# Altium schematic sheet Sheet_SiPM.SchDoc
size A4; SheetNumber: 1; SheetTotal: 1
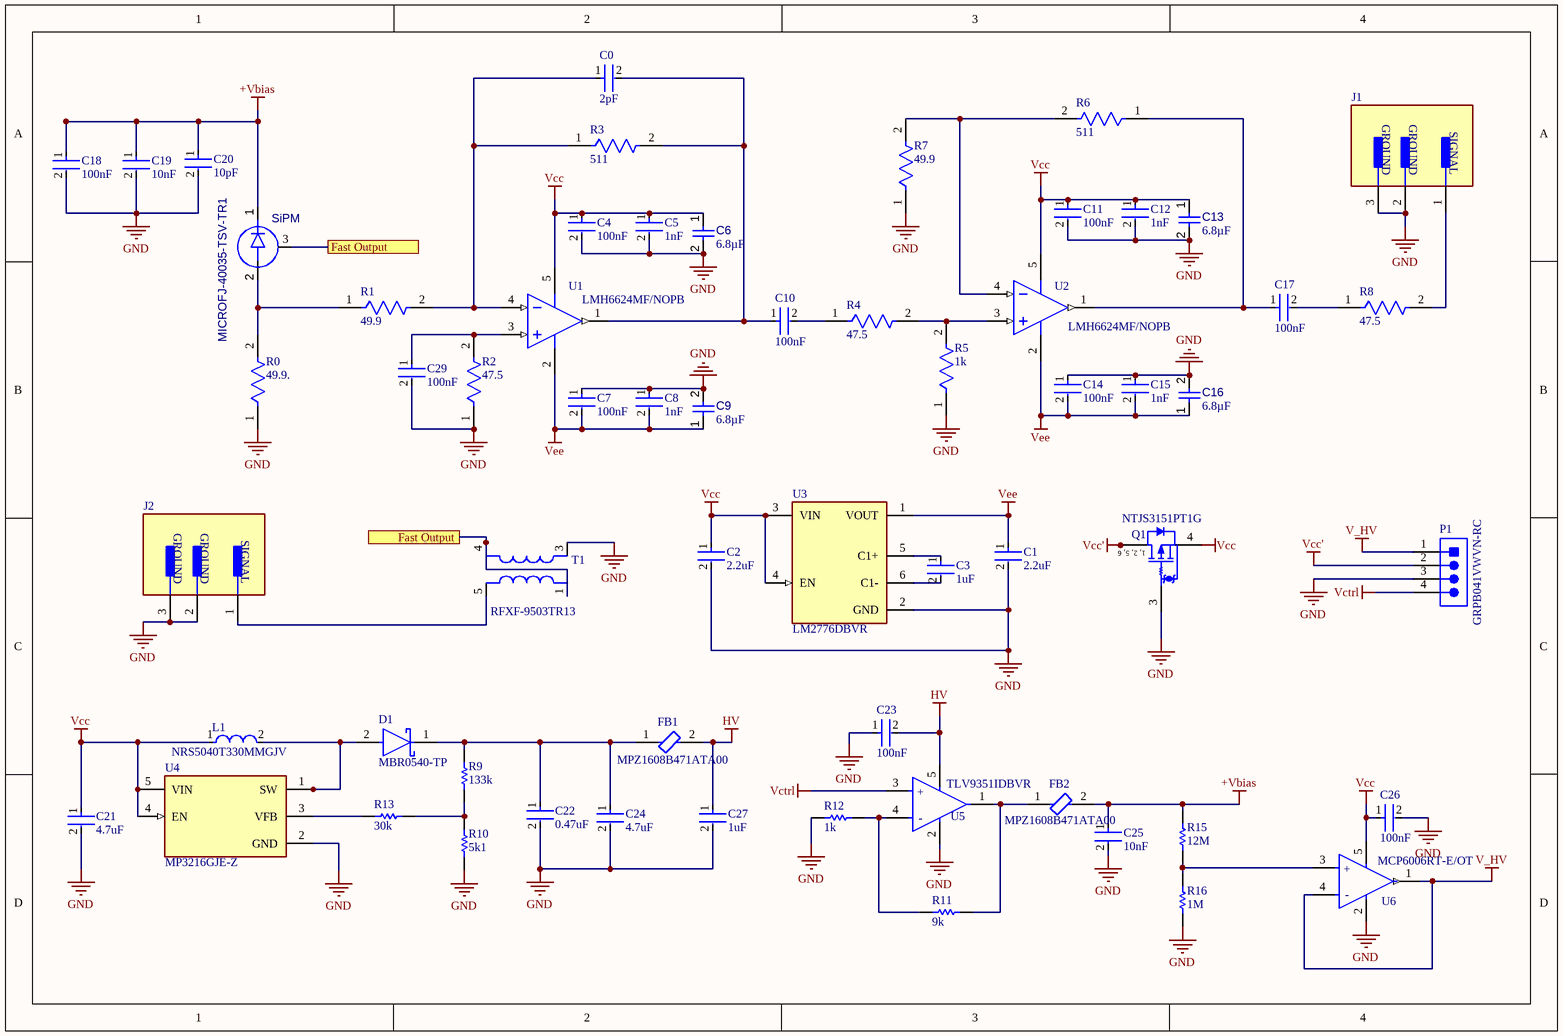
[diagram p0: Sheet_SiPM.SchDoc]

## Parts
C0  2pF  [FP-0603-L_1_6_0_15-W_0_81-MFG]
C1  2.2uF  [FP-GRM188-0_2-MFG]
C2  2.2uF  [FP-GRM188-0_2-MFG]
C3  1uF  [FP-CC0603-DA-MFG]
C4  100nF  [FP-CC0603-DA-MFG]
C5  1nF  [FP-CC0603-DA-MFG]
C6  value 6.8µF  [TPSA685K016R1500-Footprint-1]  (hidden comment: TPSA685K016R1500)
C7  100nF  [FP-CC0603-DA-MFG]
C8  1nF  [FP-CC0603-DA-MFG]
C9  value 6.8µF  [TPSA685K016R1500-Footprint-1]  (hidden comment: TPSA685K016R1500)
C10  100nF  [FP-CC0603-DA-MFG]
C11  100nF  [FP-CC0603-DA-MFG]
C12  1nF  [FP-CC0603-DA-MFG]
C13  value 6.8µF  [TPSA685K016R1500-Footprint-1]  (hidden comment: TPSA685K016R1500)
C14  100nF  [FP-CC0603-DA-MFG]
C15  1nF  [FP-CC0603-DA-MFG]
C16  value 6.8µF  [TPSA685K016R1500-Footprint-1]  (hidden comment: TPSA685K016R1500)
C17  100nF  [FP-CC0603-DA-MFG]
C18  100nF  [FP-CC0603-DA-MFG]
C19  10nF  [FP-CC0603-DA-MFG]
C20  10pF  [FP-AC0603-MFG]
C21  4.7uF  [FP-0603-L_1_6_0_1-W_0_8_0-MFG]
C22  0.47uF  [FP-0603-L_1_6_0_1-W_0_8_0-MFG]
C23  100nF  [FP-CC0603-DA-MFG]
C24  4.7uF  [FP-0603-L_1_6_0_15-W_0_8-MFG]
C25  10nF  [FP-CC0603-DA-MFG]
C26  100nF  [FP-CC0603-DA-MFG]
C27  1uF  [FP-CC0603-DA-MFG]
C29  100nF  [FP-CC0603-DA-MFG]
D1  MBR0540-TP  [FP-SOD-123-MFG]
FB1  MPZ1608B471ATA00  [FP-MPZ1608-0_8-MFG]
FB2  MPZ1608B471ATA00  [FP-MPZ1608-0_8-MFG]
J1  2337019-1  [FP-2337019-1-MFG]  (value not drawn)
J2  2337019-1  [FP-2337019-1-MFG]  (value not drawn)
L1  NRS5040T330MMGJV  [FP-NR5040-H_4_0-MFG]
P1  GRPB041VWVN-RC  [SLIN-GRPB041VWVN-RC_V]
Q1  NTJS3151PT1G  [ONSC-SC70-6-419B-02_W_V]
R0  49.9.  [FP-RNCP0603-MFG]
R1  49.9  [FP-RNCP0603-MFG]
R2  47.5  [FP-RNCP0603-MFG]
R3  511  [FP-MCT0603-MFG]
R4  47.5  [FP-RNCP0603-MFG]
R5  1k  [FP-MCT0603-MFG]
R6  511  [FP-MCT0603-MFG]
R7  49.9  [FP-RNCP0603-MFG]
R8  47.5  [FP-RNCP0603-MFG]
R9  133k  [RESC2013X60X35LL10T20]
R10  5k1  [RESC2013X60X35LL10T20]
R11  9k  [RESC2013X60X35LL10T20]
R12  1k  [RESC2013X60X35LL10T20]
R13  30k  [RESC2013X60X35LL10T20]
R15  12M  [RESC2013X60X35LL10T20]
R16  1M  [RESC2013X60X35LL10T20]
SiPM  MICROFJ-40035-TSV-TR1
T1  RFXF-9503TR13  [RFXF-9503TR13-Footprint-1]
U1  LMH6624MF/NOPB  [DBV0005A_L]
U2  LMH6624MF/NOPB  [DBV0005A_L]
U3  LM2776DBVR  [FP-DBV0006A-MFG]
U4  MP3216GJE-Z  [MP3216GJE-Z-Footprint-1]
U5  TLV9351IDBVR  [FP-DBV0005A-MFG]
U6  MCP6006RT-E/OT  [FP-C04-091-OT-MFG]

## Ports
Fast Output (see Sheet_SiPM[1A]), Fast Output (see Sheet_SiPM[1C])

## Nets
+Vbias: C18.1 C19.1 C20.1 C25.1 FB2.2 R15.2 SiPM.1(K)
GND: C1.2 C2.2 C4.2 C5.2 C6.2 C7.1 C8.1 C9.2 C11.2 C12.2 C13.2 C14.1 C15.1 C16.2 C18.2 C19.2 C20.2 C21.2 C22.2 C23.1 C24.2 C25.2 C26.2 C27.2 C29.2 J1.2(GROUND) J1.3(GROUND) J2.2(GROUND) J2.3(GROUND) P1.3 Q1.3(G) R0.1 R2.1 R5.1 R7.1 R10.1 R12.2 R16.1 T1.3 U3.2(GND) U4.2(GND) U5.2(V-) U6.2(VSS)
HV: C23.2 C27.1 FB1.2 U5.5(V+)
V_HV: P1.1 U6.1(VOUT) U6.4(VIN-)
Vcc: C2.1 C4.1 C5.1 C6.1 C11.1 C12.1 C13.1 C21.1 C26.1 L1.1 Q1.4(S) U1.5(V+) U2.5(V+) U3.3(VIN) U3.4(EN) U4.4(EN) U4.5(VIN) U6.5(VDD)
Vcc': P1.2 Q1.1(D) Q1.2(D) Q1.5(D) Q1.6(D)
Vctrl: P1.4 U5.3(IN+)
Vee: C1.1 C7.2 C8.2 C9.1 C14.2 C15.2 C16.1 U1.2(V-) U2.2(V-) U3.1(VOUT)
Fast Output: SiPM.3(F) T1.1 T1.4 ; port Fast Output
NetC0_1: C0.1 R1.2 R3.1 U1.4(IN-)
NetC0_2: C0.2 C10.1 R3.2 U1.1(OUT)
NetC3_1: C3.1 U3.5(C1+)
NetC3_2: C3.2 U3.6(C1-)
NetC10_2: C10.2 R4.1
NetC17_1: C17.1 R6.1 U2.1(OUT)
NetC17_2: C17.2 R8.1
NetC22_1: C22.1 C24.1 D1.1(C) FB1.1 R9.2
NetC29_1: C29.1 R2.2 U1.3(IN+)
NetD1_2: D1.2(A) L1.2 U4.1(SW)
NetFB2_1: FB2.1 R11.1 U5.1(OUT)
NetJ1_1: J1.1(SIGNAL) R8.2
NetJ2_1: J2.1(SIGNAL) T1.5
NetR0_2: R0.2 R1.1 SiPM.2(A)
NetR4_2: R4.2 R5.2 U2.3(IN+)
NetR6_2: R6.2 R7.2 U2.4(IN-)
NetR9_1: R9.1 R10.2 R13.1
NetR11_2: R11.2 R12.1 U5.4(IN-)
NetR13_2: R13.2 U4.3(VFB)
NetR15_1: R15.1 R16.2 U6.3(VIN+)

## Notes on the sheet
- (in symbol CMP-00252-117321646-1) +; -
- (in symbol CMP-1058-00634-1) 1, 2, 5, 6
- (in symbol CMP-04895-000384-1) +; -

## Library data of the parts
C0 = CMP-2006-04257-2: General Purpose Ceramic Capacitor, 0603, 1pF, 0.1pF, NP0, 30ppm/°C, 50V; Dielectric: C0G; Voltage Rating: 50V; Max Operating Temperature: 125°C; Lead Free: Lead Free; Mount: Surface Mount; Length: 1.6mm; Thickness: 0.035inch; Series: -; RoHS Compliant: Yes; Depth: 0.81mm; Construction: Flat; Voltage Rating (DC): 50V; Package Quantity: 4000; Case Code (Imperial): 0603; Height: 0.035mm; Case Code (Metric): 1608; Capacitance: 1pF; Packaging: Tape and Reel; Case/Package: 0603; Termination: SMD/SMT; Width: 0.032inch; Min Operating Temperature: -55°C; Radiation Hardening: No
C1 C2 = CMP-06035-057307-1: Chip Multilayer Ceramic Capacitors for General Purpose, 0603, 2.2uF, X7R, 15%, 10%, 16V; Case/Package: 0603
C3 = CMP-03422-000924-1: CAP CER 1UF 16V X7R 0603; Manufacturer: YAGEO; Manufacturer Part Number: CC0603KRX7R7BB105; Tolerance: 0.1; Temperature Coefficient: 15%; Material: Ceramic; Package: CC0603-DA; RoHS: TRUE; Device Class L2: Capacitors; Temperature Characteristic: X7R; Temperature: -55°C to +125°C; Temperature Range Low: -55°C; Automotive: No; ComponentLink2Description: Datasheet; Value: 1 uF; Lead Free: Yes; Capacitance: 1 uF; ComponentLink2URL: http://www.yageo.com/documents/recent/UPY-GPHC_X7R_6.3V-to-50V_18.pdf; Device Class L1: Passive Components; Voltage: 16 V; Octopart: https://octopart.com/cc0603krx7r7bb105-yageo-42271928; Category: Cap; Digikey Description: CAP CER 1UF 16V X7R 0603; Footprint Url: http://www.yageo.com/exep/pages/download/literatures/UPY-C_GEN_24.pdf; Height: 0.9mm; Voltage Rating: 16 V; Temperature Range High: +125°C; Mouser Description: Multilayer Ceramic Capacitor, CC Series, 1 - F, - 10%, X7R, 16 V, 0603 [1608 Metric]; Device Class L3: Ceramic Capacitors
C4 C7 C10 C11 C14 C17 C26 C29 = CMP-2000-05002-2: CAP CER 0.1UF 16V X7R 0603; Manufacturer Part Number: CC0603KRX7R7BB104; Manufacturer: YAGEO; Tolerance: 0.1; Temperature Coefficient: 15%; Material: Ceramic; Voltage Rating: 16 V; Package: CC0603-DA; ComponentLink2Description: Datasheet; Octopart: https://octopart.com/cc0603krx7r7bb104-yageo-192941; Temperature Range High: +125°C; Digikey Description: CAP CER 0.1UF 16V X7R 0603; Value: 100 nF; Voltage: 16 V; Device Class L2: Capacitors; Height: 0.9mm; Temperature: -55°C to +125°C; Device Class L1: Passive Components; Device Class L3: Ceramic Capacitors; ComponentLink2URL: http://www.yageo.com/documents/recent/UPY-GPHC_X7R_6.3V-to-50V_18.pdf; Footprint Url: http://www.yageo.com/exep/pages/download/literatures/UPY-C_GEN_24.pdf; RoHS: TRUE; Temperature Range Low: -55°C; Temperature Characteristic: X7R; Lead Free: Yes; Capacitance: 100 nF; Category: Cap; Mouser Description: Multilayer Ceramic Capacitor, CC Series, 0.1 - F, - 10%, X7R, 16 V, 0603 [1608 Metric]; Automotive: No
C5 C8 C12 C15 = CMP-03422-001144-1: CAP CER 1000PF 25V X7R 0603; Manufacturer: YAGEO; Manufacturer Part Number: CC0603KRX7R8BB102; Value: 1.0 nF; Material: Ceramic; Temperature Coefficient: 15%; Tolerance: 0.1; Category: Cap; Voltage Rating: 25 V; Temperature: -55°C to +125°C; Device Class L3: Ceramic Capacitors; Octopart: https://octopart.com/cc0603krx7r8bb102-yageo-9291798; Voltage: 25 V; Lead Free: Yes; Digikey Description: CAP CER 1000PF 25V X7R 0603; Height: 0.9mm; ComponentLink2URL: http://www.yageo.com/documents/recent/UPY-GPHC_X7R_6.3V-to-50V_18.pdf; RoHS: TRUE; ComponentLink2Description: Datasheet; Package: CC0603-DA; Device Class L2: Capacitors; Temperature Range Low: -55°C; Mouser Description: Multilayer Ceramic Capacitors MLCC - SMD/SMT 1.0nF 25V X7R 10%; Capacitance: 1.0 nF; Temperature Characteristic: X7R; Automotive: No; Footprint Url: http://www.yageo.com/exep/pages/download/literatures/UPY-C_GEN_24.pdf; Device Class L1: Passive Components; Temperature Range High: +125°C
C6 C9 C13 C16 = CMP-001-00083-2: Tantalum Capacitor, Polarized, Tantalum (dry/solid), 16V, 10% +Tol, 10% -Tol, 6.8uF, Surface Mount, 1206; RoHS Compliant: Yes; Min Operating Temperature: -55°C; Capacitor Type: Tantalum; Pins: 2; Max Operating Temperature: 125°C; Mounting Technology: Surface Mount; Case/Package: 1206
C18 C23 = CMP-2100-03601-2: CAP CER 0.1UF 50V X7R 0603; Manufacturer: YAGEO; Manufacturer Part Number: CC0603KRX7R9BB104; Material: Ceramic; Temperature Coefficient: 15%; Tolerance: 0.1; Height: 0.9mm; Voltage: 50 V; ComponentLink2Description: Datasheet; Device Class L2: Capacitors; Temperature Range High: +125°C; Category: Cap; Capacitance: 100 nF; Footprint Url: http://www.yageo.com/exep/pages/download/literatures/UPY-C_GEN_24.pdf; ComponentLink2URL: http://www.yageo.com/documents/recent/UPY-GPHC_X7R_6.3V-to-50V_18.pdf; Package: CC0603-DA; Temperature: -55°C to +125°C; Voltage Rating: 50 V; Temperature Characteristic: X7R; Device Class L1: Passive Components; Temperature Range Low: -55°C; RoHS: TRUE; Automotive: No; Value: 100 nF; Device Class L3: Ceramic Capacitors; Octopart: https://octopart.com/cc0603krx7r9bb104-yageo-42244635; Mouser Description: Multilayer Ceramic Capacitor, CC Series, 0.1 - F, - 10%, X7R, 50 V, 0603 [1608 Metric]; Lead Free: Yes; Digikey Description: CAP CER 0.1UF 50V X7R 0603
C19 C25 = CMP-2100-03600-2: CAP CER 10000PF 50V X7R 0603; Manufacturer Part Number: CC0603KRX7R9BB103; Manufacturer: YAGEO; Tolerance: 0.1; Material: Ceramic; Temperature Coefficient: 15%; Mouser Description: Multilayer Ceramic Capacitor, CC Series, 0.01 - F, - 10%, X7R, 50 V, 0603 [1608 Metric]; Digikey Description: CAP CER 10000PF 50V X7R 0603; Height: 0.9mm; Category: Cap; Temperature Characteristic: X7R; Footprint Url: http://www.yageo.com/exep/pages/download/literatures/UPY-C_GEN_24.pdf; Lead Free: Yes; Voltage Rating: 50 V; Temperature: -55°C to +125°C; Device Class L3: Ceramic Capacitors; ComponentLink2Description: Datasheet; Voltage: 50 V; Package: CC0603-DA; Octopart: https://octopart.com/cc0603krx7r9bb103-yageo-192938; Automotive: No; Temperature Range High: +125°C; Temperature Range Low: -55°C; Value: 10 nF; RoHS: TRUE; Device Class L1: Passive Components; ComponentLink2URL: http://www.yageo.com/documents/recent/UPY-GPHC_X7R_6.3V-to-50V_18.pdf; Device Class L2: Capacitors; Capacitance: 10 nF
C20 = CMP-03422-001295-1: AC0603 10 pF NP0 1.00% 50 V; Manufacturer: Yageo; Manufacturer Part Number: AC0603FRNPO9BN100; Voltage Rating: 50 V; Material: Ceramic; Temperature Coefficient: 15%; Automotive Grade: Grade 1; Tolerance: 0.01; Device Class L3: Ceramic Capacitors; Value: 10 pF; Lead Free: Yes; Footprint Url: http://www.yageo.com/exep/pages/download/literatures/UPY-C_GEN_24.pdf; Height: 0.9mm; Temperature Characteristic: NP0; Temperature Range Low: -55°C; Temperature: -55°C to +125°C; ComponentLink2Description: Datasheet; Automotive: Yes; Device Class L2: Capacitors; Device Class L1: Passive Components; Ipc Land Pattern Name: CAPC16080X80; Package: AC0603; Category: Cap; Capacitance: 10 pF; Temperature Range High: +125°C; RoHS: TRUE; ComponentLink2URL: http://www.yageo.com/documents/recent/UPY-AC_NP0X7R_16V-to-630V_12.pdf; Octopart: https://octopart.com/ac0603frnpo9bn100-yageo-87214046
C21 C22 = CMP-14477-000135-3: Ceramic Capacitor General Use 0.47uF ±10% 50V X7R 0603; NexarPartId: 22313259; Capacitance: 470nF; Max Length: 1.7mm; Mount: Surface Mount; Length: 1.6mm; Min Operating Temperature: -55°C; Case/Package: 0603; Schedule B: 8532240020; Voltage Rating (DC): 50V; Height: 900µm; Depth: 800µm; Halogen Free: Halogen Free; Dielectric: X7R; Case Code (Imperial): 0603; Voltage: 50V; Max Width: 900µm; Max Operating Temperature: 125°C; Termination: SMD/SMT; Max Thickness: 900µm; Voltage Rating: 50V; RoHS: Compliant; Min Width: 700µm; Width: 787.4µm; Lead Free: Lead Free; Min Length: 1.5mm; Min Thickness: 700µm; Tolerance: 10%; Radiation Hardening: No; Case Code (Metric): 1608; Material: Ceramic; Thickness: 889µm; Packaging: Digi-Reel®
C24 = CMP-2000-07531-4: Ceramic Capacitor General Use 1uF ±10% 50V X7R 0603; Series: M; Width: 0.031inch; Mount: Surface Mount; Radiation Hardening: No; Voltage Rating (DC): 50V; Packaging: Tape and Reel; Termination: SMD/SMT; Depth: 0.8mm; Case Code (Metric): 1608; Case Code (Imperial): 0603; Height: 0.8mm; Voltage Rating: 50V; Package Quantity: 1; Halogen Free: Halogen Free; Dielectric: X7R; Min Operating Temperature: -55°C; Length: 1.6mm; Construction: Flat; Tolerance: 10%; Thickness: 0.037inch; Max Operating Temperature: 125°C; Case/Package: 0603; Capacitance: 1uF; RoHS Compliant: Yes
C27 = CMP-2100-03600-2: CAP CER 10000PF 50V X7R 0603; Manufacturer Part Number: CC0603KRX7R9BB103; Manufacturer: YAGEO; Tolerance: 0.1; Material: Ceramic; Temperature Coefficient: 15%; Value: 10 nF; Mouser Description: Multilayer Ceramic Capacitor, CC Series, 0.01 - F, - 10%, X7R, 50 V, 0603 [1608 Metric]; Digikey Description: CAP CER 10000PF 50V X7R 0603; Height: 0.9mm; Category: Cap; Temperature Characteristic: X7R; Footprint Url: http://www.yageo.com/exep/pages/download/literatures/UPY-C_GEN_24.pdf; Lead Free: Yes; Voltage Rating: 50 V; Temperature: -55°C to +125°C; Device Class L3: Ceramic Capacitors; ComponentLink2Description: Datasheet; Voltage: 50 V; Package: CC0603-DA; Octopart: https://octopart.com/cc0603krx7r9bb103-yageo-192938; Automotive: No; Temperature Range High: +125°C; Temperature Range Low: -55°C; RoHS: TRUE; Device Class L1: Passive Components; ComponentLink2URL: http://www.yageo.com/documents/recent/UPY-GPHC_X7R_6.3V-to-50V_18.pdf; Device Class L2: Capacitors; Capacitance: 10 nF
D1 = CMP-2000-06672-2: DIODE SCHOTTKY 40V 500MA SOD123; Polarity: Standard; Peak Non-Repetitive Surge Current: 5.5A; Forward Voltage: 550mV; Peak Reverse Current: 200uA; Element Configuration: Single; Capacitance: 30pF; Max Reverse Voltage (DC): 40V; Package Quantity: 1; Packaging: Tape and Reel; Min Operating Temperature: -55°C; Forward Current: 500mA; Average Rectified Current: 500mA; Max Operating Temperature: 150°C; Current Rating: 500mA; Max Forward Surge Current (Ifsm): 5.5A; Radiation Hardening: No; Output Current: 500mA; Lead Free: Lead Free; Mount: Surface Mount; Max Repetitive Reverse Voltage (Vrrm): 40V; Number of Pins: 2; Voltage Rating (DC): 40V
FB1 FB2 = CMP-08257-000382-1: Power line Ferrite Bead 470Ω @ 100MHz 1A DCR 0.15Ω SMD 0603; DC Resistance (DCR): 150mR; Impedance: 470R; Tolerance: 25%; Length: 0.063inch; Height: 0.037inch; Packaging: Tape and Reel; REACH SVHC: No SVHC; Current Rating: 1A; Package Quantity: 4000; Mount: Surface Mount; Core Material: Ferrite; Case Code (Imperial): 0603; Max DC Current: 1A; RoHS Compliant: Yes; Width: 0.031inch; Case/Package: 0603; Case Code (Metric): 1608
J1 J2 = CMP-03357-000011-1: UMCC MICRO-COAX RECEPTACLE, GEN
L1 = CMP-14484-000440-1: SMD Power Inductors for Automotive Applications 33uH ±20% 1.2A 0.234Ω; Core Material: Ferrite; Self Resonant Frequency: 7MHz; Shielding: Shielded; Test Frequency: 100kHz; Saturation Current: 1.3A; DC Resistance (DCR): 234mR; Length: 0.193inch; Tolerance: 20%; RoHS Compliant: Yes; Inductance: 33uH; Max Operating Temperature: 125°C; Resistor Type: Wirewound; Current Rating: 1.2A; Height - Seated (Max): 0.157inch; Width: 0.193inch; Packaging: Tape and Reel; Min Operating Temperature: -40°C; Case/Package: Nonstandard; Mount: Surface Mount
P1 = CMP-2000-06373-1: Male Header, Pitch 1.27 mm, 1 x 4 Position, Height 4 mm, Tail Length 2.3 mm, -40 to 105 degC, RoHS, Bulk; Manufacturer: Sullins; Mating Products: S9010E-04-ND / -CONNHEADER.050"4POSR/APCB / S9008E-04-ND / -CONNHEADER.050"4POSPCBGOLD / S9005E-04-ND / -CONNHEADER.050"4POSSMDGOLD; Other Names: S9014E-04; Dynamic Catalog: GRPB; Pitch: 0.050"(1.27mm); Number of Positions Loaded: All; Number of Positions: 4; Catalog Drawings: S9014ESeriesTop; Connector Type: Header,Unshrouded; Contact Finish Thickness: Flash; Number of Rows: 1; Contact Type: MalePin; Category: Connectors,Interconnects; Contact Mating Length: 0.118"(3.00mm); Family: RectangularConnectors-Headers,MalePins; Datasheet Version: Rev. C, 12/2008; Contact Finish: Gold; Termination: Solder; Manufacturer URL: http://www.sullinscorp.com/; Mounting Type: ThroughHole; Packaging: Bulk; Package Reference: GRPB041VWVN-RC; Datasheet URL: http://www.sullinscorp.com/drawings/71_GRPB___1VWVN-RC,_10957-C.pdf; Mounting Technology: ThroughHole; Package Description: Male Header, Pitch 1.27 mm, 1 x 4 Position, Height 4 mm, Tail Length 2.3 mm; Standard Package: 1
Q1 = CMP-1058-00634-1: Trench Power MOSFET, 12 V, 3.3 A, Single P-Channel, ESD Protected, 6-Pin SC70, Pb-Free, Tape and Reel; Manufacturer: On Semiconductor; PD Max (W): 0.625; Coss Typ (pF): 170; Channel Polarity: P Channel; V(BR)DSS Min (V): 12; ID Max (A): 3.3; Ciss Typ (pF): 850; Crss Typ (pF): 110; ComponentLink3URL: http://www.onsemi.com/pub_link/Collateral/SMF05C-D.PDF; PackageReference: SC70-6-419B-02_W; Package Type: SC-88-6 / SC-70-6 / SOT-363-6; ComponentLink3Description: Package Specification; Configuration: Single; PackageVersion: Rev. W; PackageDescription: 6-Pin Small Outline Transistor, Body 2 x 1.25 mm, Pitch 0.65 mm; ComponentLink1URL: http://www.onsemi.com/; DatasheetVersion: Rev. 2; ComponentLink2URL: http://www.onsemi.com/pub_link/Collateral/NTJS3151P-D.PDF; Mounting Technology: Surface Mount; ComponentLink2Description: Datasheet; Packing: Tape and Reel; VGS Max (V): 12; PartNumber: NTJS3151PT1G; RoHS: Pb-Free; ComponentLink1Description: Manufacturer URL
R0 R1 R7 = CMP-26527-005229-1: 49.9Ω ±1% 0.125W 0603 High Power Anti-Sulfur Thin Film Chip Resistor; Temperature Coefficient: 100ppm/°C; Resistance: 49.9R; Max Power Dissipation: 125mW; Max Operating Temperature: 155°C; Resistor Type: Thin Film; Case Code (Metric): 1608; Case/Package: 0603; Tolerance: 1%; Length: 0.059inch; Mount: Surface Mount; Case Code (Imperial): 0603; Features: Moisture Resistant; Series: RNCP; Height: 0.02inch; Min Operating Temperature: -55°C; Number of Terminations: 2; Packaging: Cut Tape; Width: 0.031inch; Lead Free: Lead Free; RoHS Compliant: Yes
R2 R4 R8 = CMP-26527-005114-1: 47.5Ω ±1% 0.125W 0603 High Power Anti-Sulfur Thin Film Chip Resistor; Temperature Coefficient: 100ppm/°C; Resistance: 47.5R; Max Power Dissipation: 125mW; Features: Moisture Resistant; Packaging: Tape and Reel; Height: 0.02inch; Max Operating Temperature: 155°C; Case/Package: 0603; Length: 0.059inch; Case Code (Metric): 1608; Number of Terminations: 2; Tolerance: 1%; RoHS Compliant: Yes; Resistor Type: Thin Film; Case Code (Imperial): 0603; Width: 0.031inch; Series: RNCP; Mount: Surface Mount; Min Operating Temperature: -55°C
R3 = CMP-02407-000044-1: RES SMD 100 OHM 1% 1/8W 0603; Resistance: 470R; Temperature Coefficient: 50ppm/°C; Voltage Rating (DC): 75V; Max Power Dissipation: 125mW; Width: 0.033inch; Packaging: Tape and Reel; Package Quantity: 1; Max Operating Temperature: 125°C; Tolerance: 1%; Height: 0.022inch; Case Code (Metric): 1608; Length: 0.061inch; Case/Package: 0603; REACH SVHC: No SVHC; Military Standard: Not; Number of Terminations: 2; Contact Plating: Tin; Depth: 0.85mm; Case Code (Imperial): 0603; Voltage Rating: 75V; Composition: Thin Film; Radiation Hardening: No; Lead Free: Lead Free; Min Operating Temperature: -55°C; Power Rating: 125mW
R5 R6 = CMP-02407-005727-1: RES SMD 100 OHM 1% 1/8W 0603; Max Power Dissipation: 100mW; Resistance: 1kR; Temperature Coefficient: 50ppm/°C; Min Operating Temperature: -55°C; Number of Terminations: 2; Military Standard: Not; Lead Free: Lead Free; Max Operating Temperature: 125°C; Height: 0.022inch; Depth: 0.85mm; Width: 0.033inch; Case/Package: 0603; Packaging: Tape and Reel; Tolerance: 1%; Length: 0.061inch; Composition: Thin Film
R9 R11 R12 R15 R16 = CMP-2001-00968-1: Manufacturer: Yageo; Part Number: RC0805FR-071M05L
R10 R13 = CMP-2001-01383-1: Manufacturer: Yageo; Part Number: RC0805JR-0743KL
SiPM = CMP-004-00031-2: Avalanche Photodiode; RoHS Compliant: Yes
T1 = CMP-012-00000-1: SMT Transformer 3MHZ-3GHZ
U1 U2 = CMP-0055-01252-3: Single/ Dual Ultra Low Noise Wideband Operational Amplifier, 5-pin SOT-23, Pb-Free; Manufacturer: Texas Instruments; CompType: Amplifiers; PowerWise: Y; PackageTopMarking: A94A*XTT; PinCount: 5; ComponentLink1URL: http://www.ti.com/general/docs/lit/getliterature.tsp?genericPartNumber=LMH6624&fileType=pdf; RoHS: Y; Package Reference: DBV0005A; ComponentLink1Description: Datasheet URL; PackageDescription: Molded SOT-23, .115 x .063 x .040 in Body, 5 Lead, .0375 in Pitch
U3 = CMP-04918-000109-1: IC REG CHARGE PUMP INV SOT23; Manufacturer: Texas Instruments; Nominal Supply Current: 100uA; Switching Frequency: 2MHz; Number Of Outputs: 1; Standoff Height: 0mm; Min Supply Voltage: 2.7V; Output Current: 200mA; Max Supply Voltage: 5.5V; Output Type: Fixed; Max Junction Temp: +125°C; Negative Voltage Available: true; Output Voltage: -2.7-5.5V; Device Class L2: Power Management ICs; Temperature: -40°C to +85°C; Digikey Description: IC REG CHARGE PUMP INV SOT23; Octopart: https://octopart.com/lm2776dbvr-texas+instruments-58839919; Package: DBV0006A; ComponentLink2Description: Datasheet; Manufacturer Part Number: LM2776DBVR; Ambient Temperature Range Low: -40°C; RoHS: TRUE; Temperature Range Low: -40°C; Lead Free: Yes; Automotive: No; Ambient Temperature Range High: +85°C; Device Class L1: Integrated Circuits (ICs); Category: IC; Device Class L3: Voltage Regulators - Switching; Switching Topology: Charge Pump; Height: 1.45mm; ComponentLink2URL: http://www.ti.com/lit/ds/symlink/lm2776.pdf; Temperature Range High: +85°C
U4 = CMP-00024-00006-1: Switching Regulator
U5 = CMP-04895-000384-1: OPAMP
U6 = CMP-00252-117321646-1: MCP6006RT-E/OT Operational Amplifier, 1 Func, 1600uV Offset-Max, CMOS, PDSO5; Number of Channels: 1; NexarPartId: 117321646